# Altium schematic sheet Safety Thermocouple Interface - IO.SchDoc: Thermocouple Interface - IO
size A3; Organization: PEI; Address1: 22 Russell Crescent; Address2: Western Heights; Address3: Rotorua; Address4: New Zealand 3015; DocumentNumber: N/A; Revision: 0; SheetNumber: 2; SheetTotal: 2
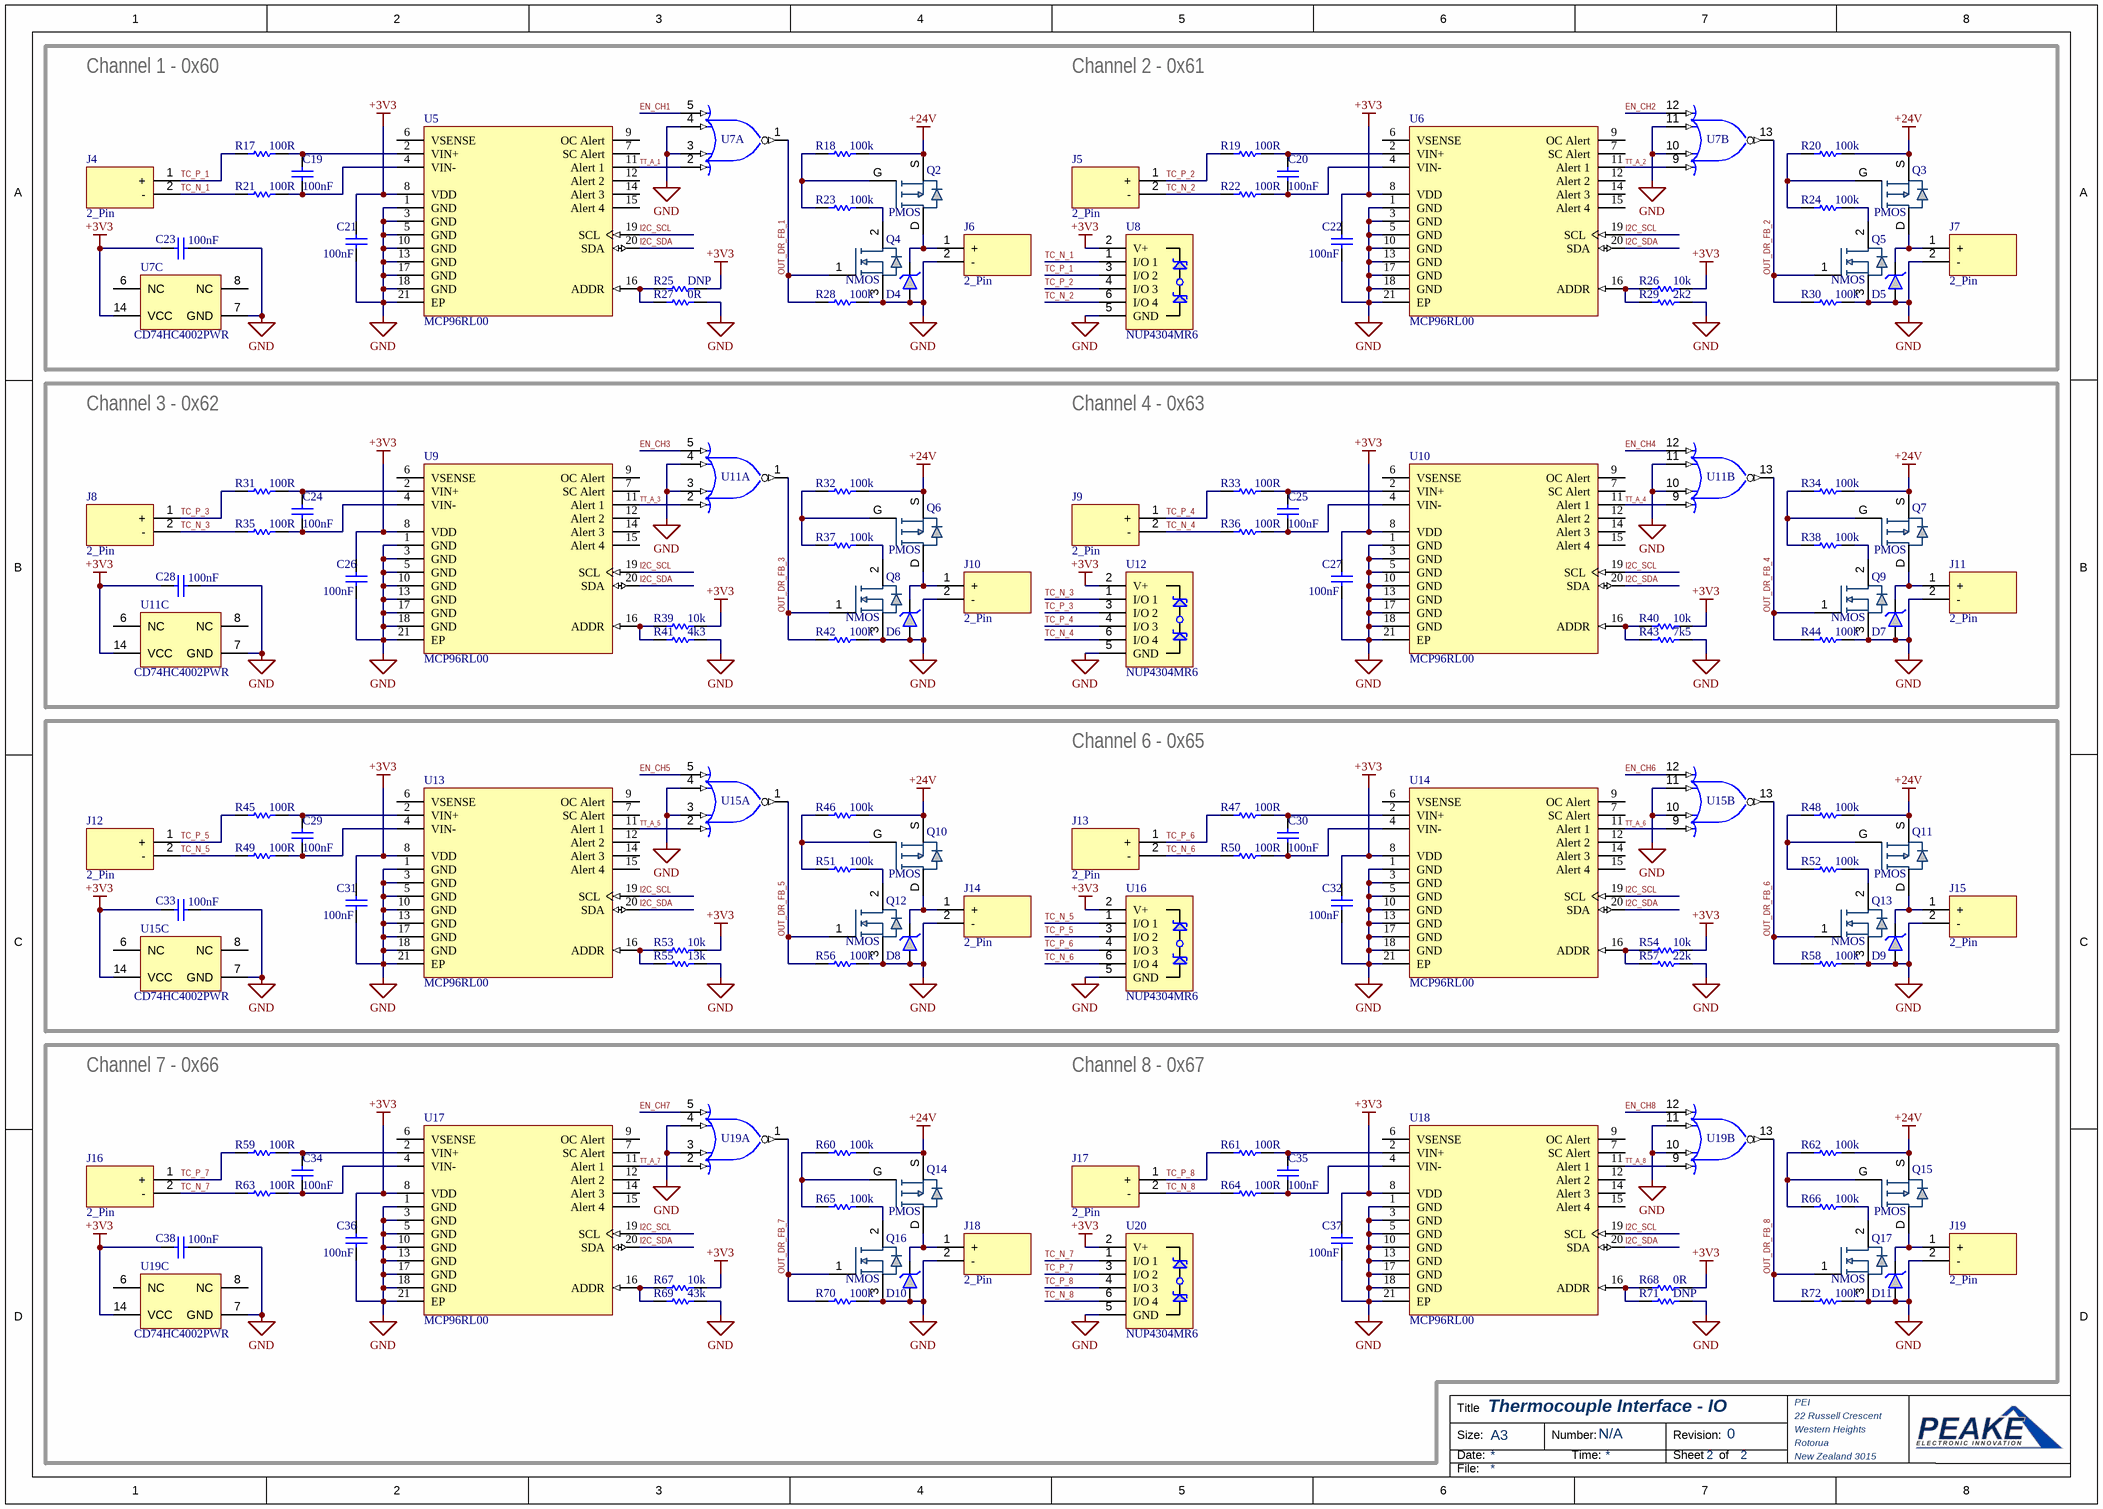
[diagram p0: Safety Thermocouple Interface - IO.SchDoc]

## Parts
C19  value 100nF  [0603_CAP]  (hidden comment: Capacitor)
C20  value 100nF  [0603_CAP]  (hidden comment: Capacitor)
C21  value 100nF  [0603_CAP]  (hidden comment: Capacitor)
C22  value 100nF  [0603_CAP]  (hidden comment: Capacitor)
C23  value 100nF  [0603_CAP]  (hidden comment: Capacitor)
C24  value 100nF  [0603_CAP]  (hidden comment: Capacitor)
C25  value 100nF  [0603_CAP]  (hidden comment: Capacitor)
C26  value 100nF  [0603_CAP]  (hidden comment: Capacitor)
C27  value 100nF  [0603_CAP]  (hidden comment: Capacitor)
C28  value 100nF  [0603_CAP]  (hidden comment: Capacitor)
C29  value 100nF  [0603_CAP]  (hidden comment: Capacitor)
C30  value 100nF  [0603_CAP]  (hidden comment: Capacitor)
C31  value 100nF  [0603_CAP]  (hidden comment: Capacitor)
C32  value 100nF  [0603_CAP]  (hidden comment: Capacitor)
C33  value 100nF  [0603_CAP]  (hidden comment: Capacitor)
C34  value 100nF  [0603_CAP]  (hidden comment: Capacitor)
C35  value 100nF  [0603_CAP]  (hidden comment: Capacitor)
C36  value 100nF  [0603_CAP]  (hidden comment: Capacitor)
C37  value 100nF  [0603_CAP]  (hidden comment: Capacitor)
C38  value 100nF  [0603_CAP]  (hidden comment: Capacitor)
D4  Transil  [SMBJ]  (value not drawn)
D5  Transil  [SMBJ]  (value not drawn)
D6  Transil  [SMBJ]  (value not drawn)
D7  Transil  [SMBJ]  (value not drawn)
D8  Transil  [SMBJ]  (value not drawn)
D9  Transil  [SMBJ]  (value not drawn)
D10  Transil  [SMBJ]  (value not drawn)
D11  Transil  [SMBJ]  (value not drawn)
J4  2_Pin  [2_Pin DB2EVC-3.81-2P-GN]
J5  2_Pin  [2_Pin DB2EVC-3.81-2P-GN]
J6  2_Pin  [2_Pin DB2EVC-3.81-2P-GN]
J7  2_Pin  [2_Pin DB2EVC-3.81-2P-GN]
J8  2_Pin  [2_Pin DB2EVC-3.81-2P-GN]
J9  2_Pin  [2_Pin DB2EVC-3.81-2P-GN]
J10  2_Pin  [2_Pin DB2EVC-3.81-2P-GN]
J11  2_Pin  [2_Pin DB2EVC-3.81-2P-GN]
J12  2_Pin  [2_Pin DB2EVC-3.81-2P-GN]
J13  2_Pin  [2_Pin DB2EVC-3.81-2P-GN]
J14  2_Pin  [2_Pin DB2EVC-3.81-2P-GN]
J15  2_Pin  [2_Pin DB2EVC-3.81-2P-GN]
J16  2_Pin  [2_Pin DB2EVC-3.81-2P-GN]
J17  2_Pin  [2_Pin DB2EVC-3.81-2P-GN]
J18  2_Pin  [2_Pin DB2EVC-3.81-2P-GN]
J19  2_Pin  [2_Pin DB2EVC-3.81-2P-GN]
Q2  PMOS  [PowerDI 5060-8]
Q3  PMOS  [PowerDI 5060-8]
Q4  NMOS  [SOT-23]
Q5  NMOS  [SOT-23]
Q6  PMOS  [PowerDI 5060-8]
Q7  PMOS  [PowerDI 5060-8]
Q8  NMOS  [SOT-23]
Q9  NMOS  [SOT-23]
Q10  PMOS  [PowerDI 5060-8]
Q11  PMOS  [PowerDI 5060-8]
Q12  NMOS  [SOT-23]
Q13  NMOS  [SOT-23]
Q14  PMOS  [PowerDI 5060-8]
Q15  PMOS  [PowerDI 5060-8]
Q16  NMOS  [SOT-23]
Q17  NMOS  [SOT-23]
R17  value 100R  [0603_RES]  (hidden comment: Resistor)
R18  value 100k  [0603_RES]  (hidden comment: Resistor)
R19  value 100R  [0603_RES]  (hidden comment: Resistor)
R20  value 100k  [0603_RES]  (hidden comment: Resistor)
R21  value 100R  [0603_RES]  (hidden comment: Resistor)
R22  value 100R  [0603_RES]  (hidden comment: Resistor)
R23  value 100k  [0603_RES]  (hidden comment: Resistor)
R24  value 100k  [0603_RES]  (hidden comment: Resistor)
R25  value DNP  [0603_RES]  (hidden comment: Resistor)
R26  value 10k  [0603_RES]  (hidden comment: Resistor)
R27  value 0R  [0603_RES]  (hidden comment: Resistor)
R28  value 100k  [0603_RES]  (hidden comment: Resistor)
R29  value 2k2  [0603_RES]  (hidden comment: Resistor)
R30  value 100k  [0603_RES]  (hidden comment: Resistor)
R31  value 100R  [0603_RES]  (hidden comment: Resistor)
R32  value 100k  [0603_RES]  (hidden comment: Resistor)
R33  value 100R  [0603_RES]  (hidden comment: Resistor)
R34  value 100k  [0603_RES]  (hidden comment: Resistor)
R35  value 100R  [0603_RES]  (hidden comment: Resistor)
R36  value 100R  [0603_RES]  (hidden comment: Resistor)
R37  value 100k  [0603_RES]  (hidden comment: Resistor)
R38  value 100k  [0603_RES]  (hidden comment: Resistor)
R39  value 10k  [0603_RES]  (hidden comment: Resistor)
R40  value 10k  [0603_RES]  (hidden comment: Resistor)
R41  value 4k3  [0603_RES]  (hidden comment: Resistor)
R42  value 100k  [0603_RES]  (hidden comment: Resistor)
R43  value 7k5  [0603_RES]  (hidden comment: Resistor)
R44  value 100k  [0603_RES]  (hidden comment: Resistor)
R45  value 100R  [0603_RES]  (hidden comment: Resistor)
R46  value 100k  [0603_RES]  (hidden comment: Resistor)
R47  value 100R  [0603_RES]  (hidden comment: Resistor)
R48  value 100k  [0603_RES]  (hidden comment: Resistor)
R49  value 100R  [0603_RES]  (hidden comment: Resistor)
R50  value 100R  [0603_RES]  (hidden comment: Resistor)
R51  value 100k  [0603_RES]  (hidden comment: Resistor)
R52  value 100k  [0603_RES]  (hidden comment: Resistor)
R53  value 10k  [0603_RES]  (hidden comment: Resistor)
R54  value 10k  [0603_RES]  (hidden comment: Resistor)
R55  value 13k  [0603_RES]  (hidden comment: Resistor)
R56  value 100k  [0603_RES]  (hidden comment: Resistor)
R57  value 22k  [0603_RES]  (hidden comment: Resistor)
R58  value 100k  [0603_RES]  (hidden comment: Resistor)
R59  value 100R  [0603_RES]  (hidden comment: Resistor)
R60  value 100k  [0603_RES]  (hidden comment: Resistor)
R61  value 100R  [0603_RES]  (hidden comment: Resistor)
R62  value 100k  [0603_RES]  (hidden comment: Resistor)
R63  value 100R  [0603_RES]  (hidden comment: Resistor)
R64  value 100R  [0603_RES]  (hidden comment: Resistor)
R65  value 100k  [0603_RES]  (hidden comment: Resistor)
R66  value 100k  [0603_RES]  (hidden comment: Resistor)
R67  value 10k  [0603_RES]  (hidden comment: Resistor)
R68  value 0R  [0603_RES]  (hidden comment: Resistor)
R69  value 43k  [0603_RES]  (hidden comment: Resistor)
R70  value 100k  [0603_RES]  (hidden comment: Resistor)
R71  value DNP  [0603_RES]  (hidden comment: Resistor)
R72  value 100k  [0603_RES]  (hidden comment: Resistor)
U5  MCP96RL00  [FP-C04-186-IPC_B]
U6  MCP96RL00  [FP-C04-186-IPC_B]
U7  CD74HC4002PWR  [PW0014A_N]  (value not drawn)  (parts A,B,C of 3)
U8  NUP4304MR6  [TSOP-6]
U9  MCP96RL00  [FP-C04-186-IPC_B]
U10  MCP96RL00  [FP-C04-186-IPC_B]
U11  CD74HC4002PWR  [PW0014A_N]  (value not drawn)  (parts A,B,C of 3)
U12  NUP4304MR6  [TSOP-6]
U13  MCP96RL00  [FP-C04-186-IPC_B]
U14  MCP96RL00  [FP-C04-186-IPC_B]
U15  CD74HC4002PWR  [PW0014A_N]  (value not drawn)  (parts A,B,C of 3)
U16  NUP4304MR6  [TSOP-6]
U17  MCP96RL00  [FP-C04-186-IPC_B]
U18  MCP96RL00  [FP-C04-186-IPC_B]
U19  CD74HC4002PWR  [PW0014A_N]  (value not drawn)  (parts A,B,C of 3)
U20  NUP4304MR6  [TSOP-6]

## Blocks framed on the sheet
Channel 6 - 0x65: C29-C33 D8 D9 J12-J15 Q10-Q13 R45-R58 U13-U16

## Nets
+3V3: C21.2 C22.2 C23.2 C26.2 C27.2 C28.2 C31.2 C32.2 C33.2 C36.2 C37.2 C38.2 R25.1 R26.1 R39.1 R40.1 R53.1 R54.1 R67.1 R68.1 U5.8(VDD) U6.8(VDD) U7.14(VCC) U8.2(V+) U9.8(VDD) U10.8(VDD) U11.14(VCC) U12.2(V+) U13.8(VDD) U14.8(VDD) U15.14(VCC) U16.2(V+) U17.8(VDD) U18.8(VDD) U19.14(VCC) U20.2(V+)
+24V: Q2.S Q3.S Q6.S Q7.S Q10.S Q11.S Q14.S Q15.S R18.1 R20.1 R32.1 R34.1 R46.1 R48.1 R60.1 R62.1
GND: C21.1 C22.1 C23.1 C26.1 C27.1 C28.1 C31.1 C32.1 C33.1 C36.1 C37.1 C38.1 D4.1(A) D5.1(A) D6.1(A) D7.1(A) D8.1(A) D9.1(A) D10.1(A) D11.1(A) J6.2(-) J7.2(-) J10.2(-) J11.2(-) J14.2(-) J15.2(-) J18.2(-) J19.2(-) Q4.3(S) Q5.3(S) Q8.3(S) Q9.3(S) Q12.3(S) Q13.3(S) Q16.3(S) Q17.3(S) R27.1 R28.1 R29.1 R30.1 R41.1 R42.1 R43.1 R44.1 R55.1 R56.1 R57.1 R58.1 R69.1 R70.1 R71.1 R72.1 U5.1(GND) U5.3(GND) U5.5(GND) U5.10(GND) U5.13(GND) U5.17(GND) U5.18(GND) U5.21(EP) U6.1(GND) U6.3(GND) U6.5(GND) U6.10(GND) U6.13(GND) U6.17(GND) U6.18(GND) U6.21(EP) U7.3(1B) U7.4(1C) U7.7(GND) U7.10(2B) U7.11(2C) U8.5(GND) U9.1(GND) U9.3(GND) U9.5(GND) U9.10(GND) U9.13(GND) U9.17(GND) U9.18(GND) U9.21(EP) U10.1(GND) U10.3(GND) U10.5(GND) U10.10(GND) U10.13(GND) U10.17(GND) U10.18(GND) U10.21(EP) U11.3(1B) U11.4(1C) U11.7(GND) U11.10(2B) U11.11(2C) U12.5(GND) U13.1(GND) U13.3(GND) U13.5(GND) U13.10(GND) U13.13(GND) U13.17(GND) U13.18(GND) U13.21(EP) U14.1(GND) U14.3(GND) U14.5(GND) U14.10(GND) U14.13(GND) U14.17(GND) U14.18(GND) U14.21(EP) U15.3(1B) U15.4(1C) U15.7(GND) U15.10(2B) U15.11(2C) U16.5(GND) U17.1(GND) U17.3(GND) U17.5(GND) U17.10(GND) U17.13(GND) U17.17(GND) U17.18(GND) U17.21(EP) U18.1(GND) U18.3(GND) U18.5(GND) U18.10(GND) U18.13(GND) U18.17(GND) U18.18(GND) U18.21(EP) U19.3(1B) U19.4(1C) U19.7(GND) U19.10(2B) U19.11(2C) U20.5(GND)
EN_CH1: U7.5(1D)
EN_CH2: U7.12(2D)
EN_CH3: U11.5(1D)
EN_CH4: U11.12(2D)
EN_CH5: U15.5(1D)
EN_CH6: U15.12(2D)
EN_CH7: U19.5(1D)
EN_CH8: U19.12(2D)
I2C_SCL: U5.19(SCL) U6.19(SCL) U9.19(SCL) U10.19(SCL) U13.19(SCL) U14.19(SCL) U17.19(SCL) U18.19(SCL)
I2C_SDA: U5.20(SDA) U6.20(SDA) U9.20(SDA) U10.20(SDA) U13.20(SDA) U14.20(SDA) U17.20(SDA) U18.20(SDA)
OUT_DR_FB_1: Q4.1(G) R28.2 U7.1(1Y)
OUT_DR_FB_2: Q5.1(G) R30.2 U7.13(2Y)
OUT_DR_FB_3: Q8.1(G) R42.2 U11.1(1Y)
OUT_DR_FB_4: Q9.1(G) R44.2 U11.13(2Y)
OUT_DR_FB_5: Q12.1(G) R56.2 U15.1(1Y)
OUT_DR_FB_6: Q13.1(G) R58.2 U15.13(2Y)
OUT_DR_FB_7: Q16.1(G) R70.2 U19.1(1Y)
OUT_DR_FB_8: Q17.1(G) R72.2 U19.13(2Y)
TC_N_1: J4.2(-) R21.2 U8.1(I/O_1)
TC_N_2: J5.2(-) R22.2 U8.6(I/O_4)
TC_N_3: J8.2(-) R35.2 U12.1(I/O_1)
TC_N_4: J9.2(-) R36.2 U12.6(I/O_4)
TC_N_5: J12.2(-) R49.2 U16.1(I/O_1)
TC_N_6: J13.2(-) R50.2 U16.6(I/O_4)
TC_N_7: J16.2(-) R63.2 U20.1(I/O_1)
TC_N_8: J17.2(-) R64.2 U20.6(I/O_4)
TC_P_1: J4.1(+) R17.2 U8.3(I/O_2)
TC_P_2: J5.1(+) R19.2 U8.4(I/O_3)
TC_P_3: J8.1(+) R31.2 U12.3(I/O_2)
TC_P_4: J9.1(+) R33.2 U12.4(I/O_3)
TC_P_5: J12.1(+) R45.2 U16.3(I/O_2)
TC_P_6: J13.1(+) R47.2 U16.4(I/O_3)
TC_P_7: J16.1(+) R59.2 U20.3(I/O_2)
TC_P_8: J17.1(+) R61.2 U20.4(I/O_3)
TT_A_1: U5.11(Alert_1) U7.2(1A)
TT_A_2: U6.11(Alert_1) U7.9(2A)
TT_A_3: U9.11(Alert_1) U11.2(1A)
TT_A_4: U10.11(Alert_1) U11.9(2A)
TT_A_5: U13.11(Alert_1) U15.2(1A)
TT_A_6: U14.11(Alert_1) U15.9(2A)
TT_A_7: U17.11(Alert_1) U19.2(1A)
TT_A_8: U18.11(Alert_1) U19.9(2A)
NetC19_1: C19.1 R21.1 U5.4(VIN-)
NetC19_2: C19.2 R17.1 U5.2(VIN+)
NetC20_1: C20.1 R22.1 U6.4(VIN-)
NetC20_2: C20.2 R19.1 U6.2(VIN+)
NetC24_1: C24.1 R35.1 U9.4(VIN-)
NetC24_2: C24.2 R31.1 U9.2(VIN+)
NetC25_1: C25.1 R36.1 U10.4(VIN-)
NetC25_2: C25.2 R33.1 U10.2(VIN+)
NetC29_1: C29.1 R49.1 U13.4(VIN-)
NetC29_2: C29.2 R45.1 U13.2(VIN+)
NetC30_1: C30.1 R50.1 U14.4(VIN-)
NetC30_2: C30.2 R47.1 U14.2(VIN+)
NetC34_1: C34.1 R63.1 U17.4(VIN-)
NetC34_2: C34.2 R59.1 U17.2(VIN+)
NetC35_1: C35.1 R64.1 U18.4(VIN-)
NetC35_2: C35.2 R61.1 U18.2(VIN+)
NetD4_2: D4.2(K) J6.1(+) Q2.D
NetD5_2: D5.2(K) J7.1(+) Q3.D
NetD6_2: D6.2(K) J10.1(+) Q6.D
NetD7_2: D7.2(K) J11.1(+) Q7.D
NetD8_2: D8.2(K) J14.1(+) Q10.D
NetD9_2: D9.2(K) J15.1(+) Q11.D
NetD10_2: D10.2(K) J18.1(+) Q14.D
NetD11_2: D11.2(K) J19.1(+) Q15.D
NetQ2_G: Q2.G R18.2 R23.2
NetQ3_G: Q3.G R20.2 R24.2
NetQ4_2: Q4.2(D) R23.1
NetQ5_2: Q5.2(D) R24.1
NetQ6_G: Q6.G R32.2 R37.2
NetQ7_G: Q7.G R34.2 R38.2
NetQ8_2: Q8.2(D) R37.1
NetQ9_2: Q9.2(D) R38.1
NetQ10_G: Q10.G R46.2 R51.2
NetQ11_G: Q11.G R48.2 R52.2
NetQ12_2: Q12.2(D) R51.1
NetQ13_2: Q13.2(D) R52.1
NetQ14_G: Q14.G R60.2 R65.2
NetQ15_G: Q15.G R62.2 R66.2
NetQ16_2: Q16.2(D) R65.1
NetQ17_2: Q17.2(D) R66.1
NetR25_2: R25.2 R27.2 U5.16(ADDR)
NetR26_2: R26.2 R29.2 U6.16(ADDR)
NetR39_2: R39.2 R41.2 U9.16(ADDR)
NetR40_2: R40.2 R43.2 U10.16(ADDR)
NetR53_2: R53.2 R55.2 U13.16(ADDR)
NetR54_2: R54.2 R57.2 U14.16(ADDR)
NetR67_2: R67.2 R69.2 U17.16(ADDR)
NetR68_2: R68.2 R71.2 U18.16(ADDR)

Not connected (* = marked no-connect by the designer): U5 6(VSENSE) 7(SC_Alert) 9(OC_Alert) 12(Alert_2) 14(Alert_3) 15(Alert_4); U6 6(VSENSE) 7(SC_Alert) 9(OC_Alert) 12(Alert_2) 14(Alert_3) 15(Alert_4); U7 6(NC) 8(NC); U9 6(VSENSE) 7(SC_Alert) 9(OC_Alert) 12(Alert_2) 14(Alert_3) 15(Alert_4); U10 6(VSENSE) 7(SC_Alert) 9(OC_Alert) 12(Alert_2) 14(Alert_3) 15(Alert_4); U11 6(NC) 8(NC); U13 6(VSENSE) 7(SC_Alert) 9(OC_Alert) 12(Alert_2) 14(Alert_3) 15(Alert_4); U14 6(VSENSE) 7(SC_Alert) 9(OC_Alert) 12(Alert_2) 14(Alert_3) 15(Alert_4); U15 6(NC) 8(NC); U17 6(VSENSE) 7(SC_Alert) 9(OC_Alert) 12(Alert_2) 14(Alert_3) 15(Alert_4); U18 6(VSENSE) 7(SC_Alert) 9(OC_Alert) 12(Alert_2) 14(Alert_3) 15(Alert_4); U19 6(NC) 8(NC)

## Notes on the sheet
- Channel 1 - 0x60
- Channel 2 - 0x61
- Channel 3 - 0x62
- Channel 4 - 0x63
- Channel 7 - 0x66
- Channel 8 - 0x67
- Title
- Size:
- Date:
- A3
- Number:
- Time:
- Revision:
- Sheet
- of
- File:

## Library data of the parts
C19-C38 = CMP-001-00172-2: SMD Capacitor; Pins: 2; Source: Discrete.SchLib; Design Item ID: Capacitor; Component Type: Standard
D4-D11 = CMP-079-000108-2: Transient Voltage Suppressor; Component Type: Standard; Rated Voltage: *; Pin Count: 2; Source: Discrete.SchLib; Breakdown Voltage: *; Design Item ID: Transil; MFN: *; Clamping Voltage: *
J4-J19 = CMP-002-00173-4: 2 Pin Connector; Source: Connectors.SchLib; Component Type: Standard; Pin Count: 2; MFN: *; Pins: 2; Design Item ID: 2_Pin
Q2 Q3 Q6 Q7 Q10 Q11 Q14 Q15 = CMP-079-000102-2: P Channel MOSFET; MFN: *; Design Item ID: PMOS GDS; VGS Max: *; Continuous Current: *; VDS Breakdown: *; Source: P-MOS.SchLib; Component Type: Standard; Pin Count: 3
Q4 Q5 Q8 Q9 Q12 Q13 Q16 Q17 = CMP-079-000093-2: N Channel MOSFET; Design Item ID: NMOS; Source: N-MOS.SchLib; MFN: *; Pin Count: 3; Component Type: Standard
R17-R72 = CMP-009-00356-3: SMD Resistor; Pins: 2; Component Type: Standard; Design Item ID: Resistor; Source: Discrete.SchLib
U5 U6 U9 U10 U13 U14 U17 U18 = CMP-015-00011-2: Analog Circuit
U7 U11 U15 U19 = CMP-016-00000-1: NOR Gate, HC Series, 2-Func, 4-Input, CMOS, PDSO14; Nominal Supply Voltage: 4.5V; Max Supply Voltage: 6V; Min Supply Voltage: 2V; Min Operating Temperature: -55°C; Pins: 14; Logic Type: NOR GATE; Max Operating Temperature: 125°C; RoHS Compliant: Yes; Case/Package: TSSOP
U8 U12 U16 U20 = CMP-079-000096-2: ESD Protection Doide Array; Design Item ID: NUP4304MR6; Pin Count: 6; Component Type: Standard; Source: ON Semi.SchLib